# EAGLE schematic Gilbert Cell Mixer (EAGLE 9.1.2)
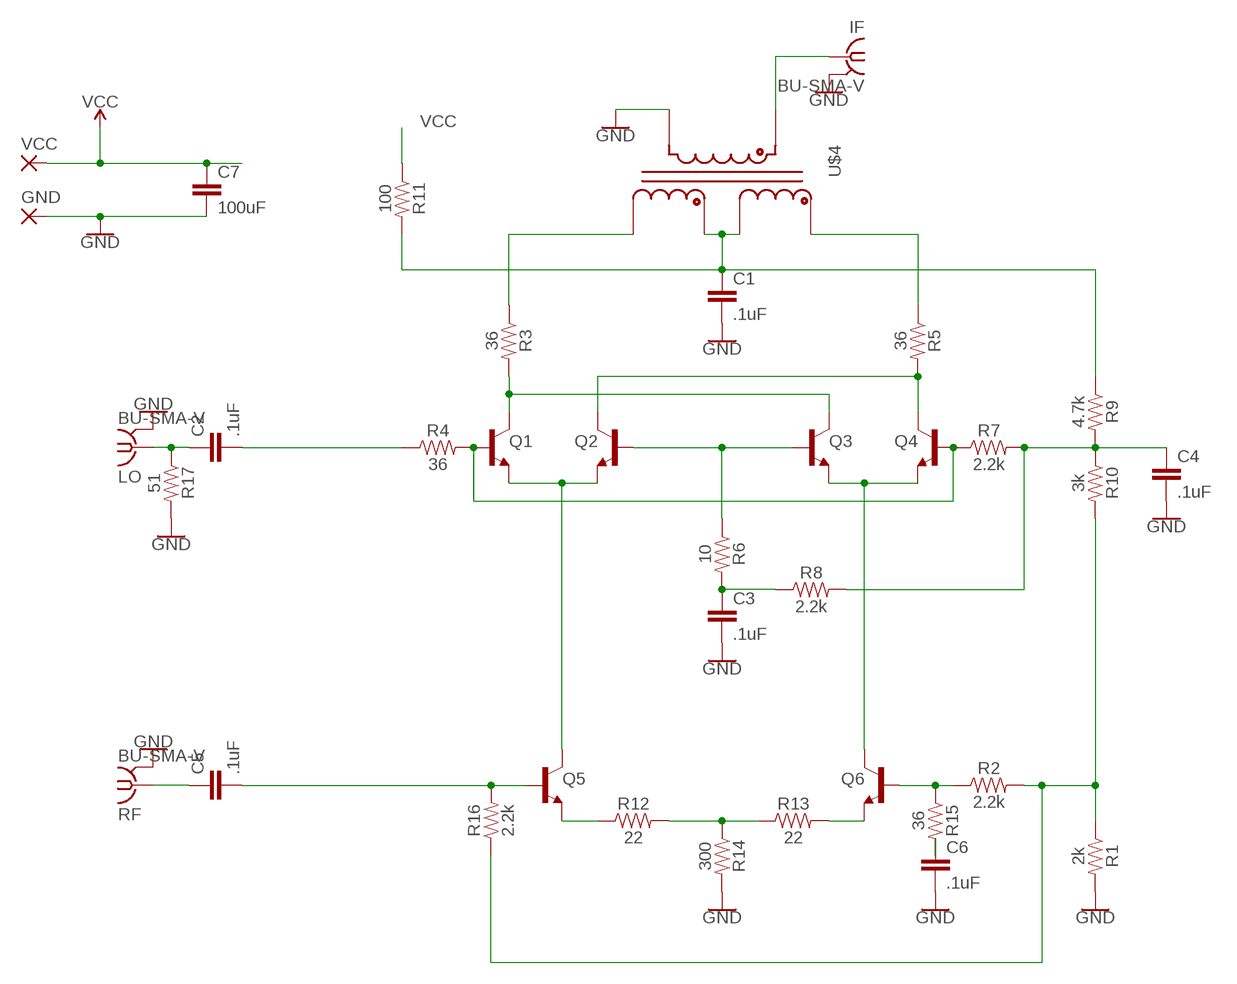
[diagram p0: schematic, sheet 1]

## Parts
C1  .1uF  C5/3.5  [C5B3.5]
C2  .1uF  C5/3.5  [C5B3.5]
C3  .1uF  C5/3.5  [C5B3.5]
C4  .1uF  C5/3.5  [C5B3.5]
C5  .1uF  C5/3.5  [C5B3.5]
C6  .1uF  C5/3.5  [C5B3.5]
C7  100uF  C5/3.5  [C5B3.5]
GND  3,17/1,1  [3,17/1,1]
IF  BU-SMA-V  [BU-SMA-V]
LO  BU-SMA-V  [BU-SMA-V]
Q1  TRANS_NPN-2N3904  [TO-92]
Q2  TRANS_NPN-2N3904  [TO-92]
Q3  TRANS_NPN-2N3904  [TO-92]
Q4  TRANS_NPN-2N3904  [TO-92]
Q5  TRANS_NPN-2N3904  [TO-92]
Q6  TRANS_NPN-2N3904  [TO-92]
R1  2k  1KOHM-HORIZ-1/4W-1%  [AXIAL-0.3]
R2  2.2k  1KOHM-HORIZ-1/4W-1%  [AXIAL-0.3]
R3  36  1KOHM-HORIZ-1/4W-1%  [AXIAL-0.3]
R4  36  1KOHM-HORIZ-1/4W-1%  [AXIAL-0.3]
R5  36  1KOHM-HORIZ-1/4W-1%  [AXIAL-0.3]
R6  10  1KOHM-HORIZ-1/4W-1%  [AXIAL-0.3]
R7  2.2k  1KOHM-HORIZ-1/4W-1%  [AXIAL-0.3]
R8  2.2k  1KOHM-HORIZ-1/4W-1%  [AXIAL-0.3]
R9  4.7k  1KOHM-HORIZ-1/4W-1%  [AXIAL-0.3]
R10  3k  1KOHM-HORIZ-1/4W-1%  [AXIAL-0.3]
R11  100  1KOHM-HORIZ-1/4W-1%  [AXIAL-0.3]
R12  22  1KOHM-HORIZ-1/4W-1%  [AXIAL-0.3]
R13  22  1KOHM-HORIZ-1/4W-1%  [AXIAL-0.3]
R14  300  1KOHM-HORIZ-1/4W-1%  [AXIAL-0.3]
R15  36  1KOHM-HORIZ-1/4W-1%  [AXIAL-0.3]
R16  2.2k  1KOHM-HORIZ-1/4W-1%  [AXIAL-0.3]
R17  51  1KOHM-HORIZ-1/4W-1%  [AXIAL-0.3]
RF  BU-SMA-V  [BU-SMA-V]
U$4  T50_SPLITTER  [T50_SPLITTER]
VCC  3,17/1,1  [3,17/1,1]

## Nets
GND: C1.2 C3.2 C4.2 C6.2 C7.2 GND.1(P) IF.2 IF.3 IF.4 IF.5 LO.2 LO.3 LO.4 LO.5 R1.P$2 R14.P$2 R17.P$2 RF.2 RF.3 RF.4 RF.5 U$4.C1A
N$1: Q1.1(E) Q2.1(E) Q5.3(C)
N$2: Q1.2(B) Q4.2(B) R4.P$2 R7.P$1
N$3: R1.P$1 R2.P$2 R10.P$2 R16.P$1
N$4: C1.1 R9.P$1 R11.P$2 U$4.C2A(C3B) U$4.C3A(C2A)
N$5: IF.1 U$4.C1B
N$6: Q3.1(E) Q4.1(E) Q6.3(C)
N$7: Q1.3(C) Q3.3(C) R3.P$2
N$8: C2.1 LO.1 R17.P$1
N$9: C3.1 R6.P$2 R8.P$1
N$10: Q2.3(C) Q4.3(C) R5.P$2
N$11: C6.1 R15.P$2
N$12: Q6.2(B) R2.P$1 R15.P$1
N$13: Q2.2(B) Q3.2(B) R6.P$1
N$14: C4.1 R7.P$2 R8.P$2 R9.P$2 R10.P$1
N$15: R3.P$1 U$4.C2B(C3A)
N$16: R5.P$1 U$4.C3B(C2B)
N$17: C2.2 R4.P$1
N$18: Q5.1(E) R12.P$1
N$19: R12.P$2 R13.P$1 R14.P$1
N$20: Q6.1(E) R13.P$2
N$21: C5.1 RF.1
N$22: C5.2 Q5.2(B) R16.P$2
VCC: C7.1 R11.P$1 VCC.1(P)

## Library data of the parts
C1-C7 = capacitor-wima:C: CAPACITOR naming: grid - package width
GND VCC = wirepad:3,17/1,1: THROUGH-HOLE PAD
IF LO RF = con-coax:BU-SMA-V: FEMALE SMA CONNECTOR Radiall distributor RS 112-3794; OC_FARNELL: unknown; OC_NEWARK: unknown
Q1-Q6 = SparkFun-DiscreteSemi:TRANS_NPN: NPN transistor Current controlled devices typically used to amplify current or used as a switch. BC547 - COM-08928 <http://www.sparkfun.com/products/8928> (TO-92 45V 100mA) (1.Collector 2.Base 3.Emitter) 2N3904 - COM-00521 <http://www.sparkfun.com/products/521> (TO-92 40V 200mA) (1.Emitter 2.Base 3.Collector) P2N2222A - COM-12852 <http://www.sparkfun.com/products/12852> (TO-92 40V 600mA) (1.Collector 2.Base 3.Emitter); PROD_ID: TRANS-08447; VALUE: 200mA/40V
R1-R17 = SparkFun-Resistors:1KOHM: 1kΩ resistor A resistor is a passive two-terminal electrical component that implements electrical resistance as a circuit element. Resistors act to reduce current flow, and, at the same time, act to lower voltage levels within circuits. - Wikipedia; PROD_ID: RES-12182; VALUE: 1k
U$4 = toroid:T50_SPLITTER: Transformer (having 3 windings) on a T50 Toroid

## Net classes
0 default: width 0.762 mm, drill 0.762 mm, clearance 0.508 mm